# Altium schematic sheet Bandpass.SchDoc: Parametrischer EQ / Spannungsregler
size A4 portrait; DocumentNumber: 3; Revision: 2; SheetNumber: 3; SheetTotal: 4
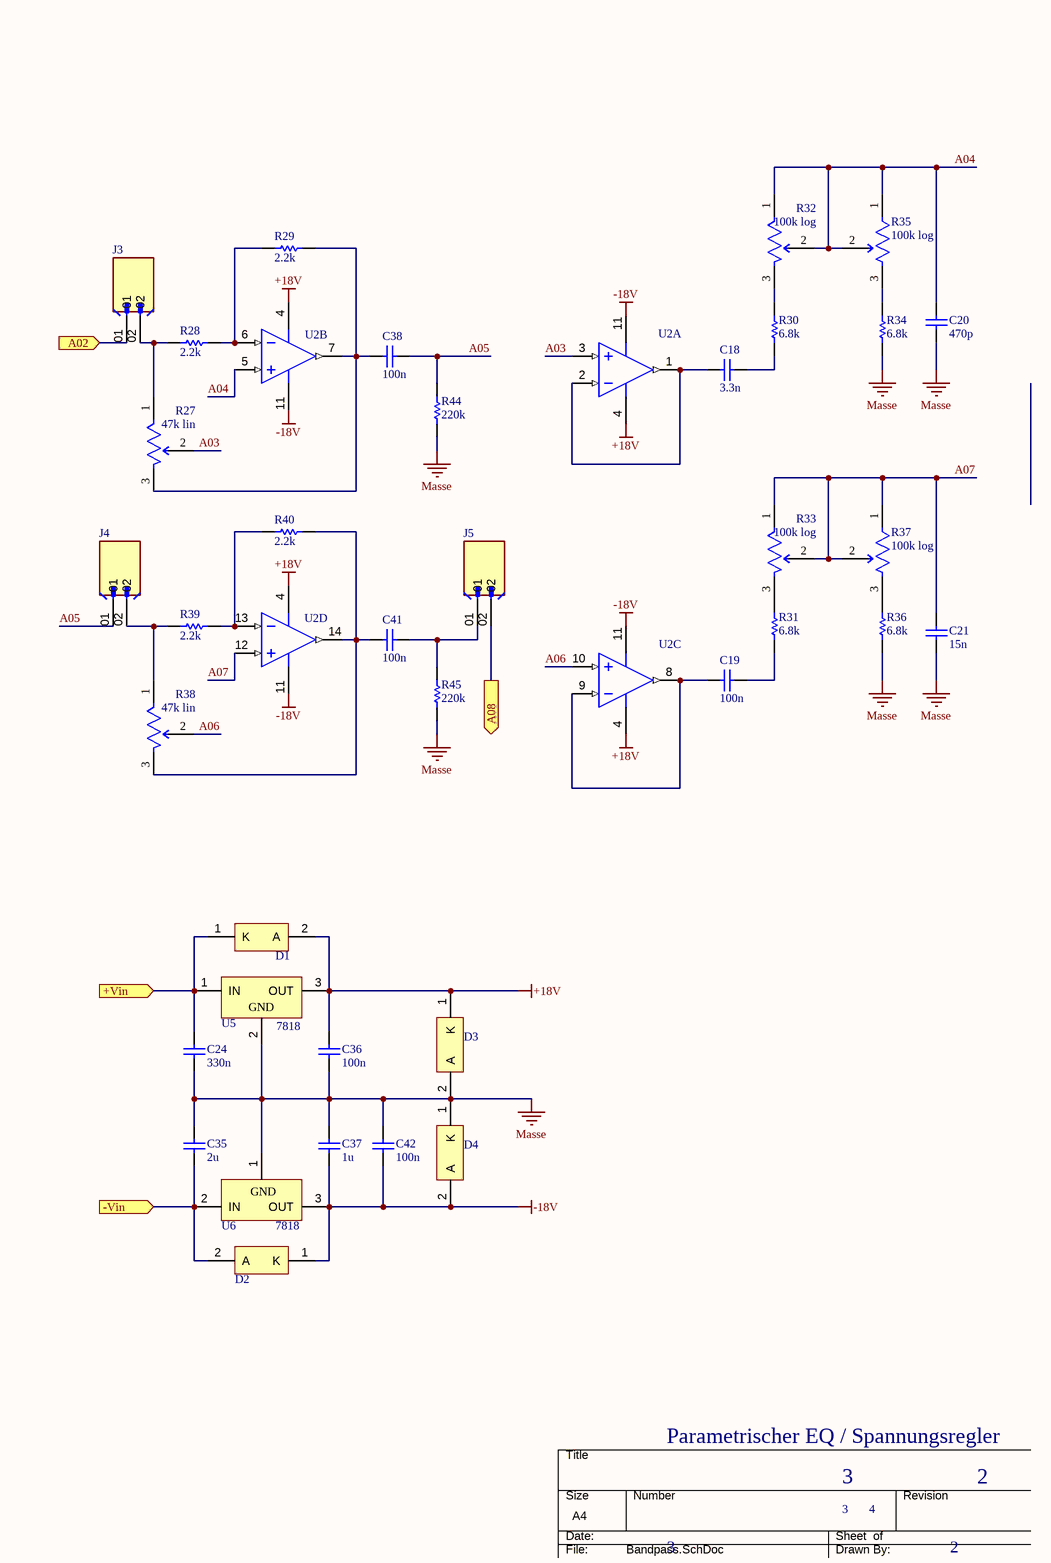
[diagram p0: Bandpass.SchDoc]

## Parts
C18  3.3n  [0805]
C19  100n  [0805]
C20  470p  [0805]
C21  15n  [0805]
C24  330n  [0805]
C35  2u  [0805]
C36  100n  [0805]
C37  1u  [0805]
C38  100n  [0805]
C41  100n  [0805]
C42  100n  [0805]
D1  1N4001 Diode  [1N4001 Diode]  (value not drawn)
D2  1N4001 Diode  [1N4001 Diode]  (value not drawn)
D3  1N4001 Diode  [1N4001 Diode]  (value not drawn)
D4  1N4001 Diode  [1N4001 Diode]  (value not drawn)
J3  Connector x2  [Connector x2]  (value not drawn)
J4  Connector x2  [Connector x2]  (value not drawn)
J5  Connector x2  [Connector x2]  (value not drawn)
R27  47k lin  [Connector x3]
R28  2.2k  [0805]
R29  2.2k  [0805]
R30  6.8k  [0805]
R31  6.8k  [0805]
R32  100k log  [Connector x3]
R33  100k log  [Connector x3]
R34  6.8k  [0805]
R35  100k log  [Connector x3]
R36  6.8k  [0805]
R37  100k log  [Connector x3]
R38  47k lin  [Connector x3]
R39  2.2k  [0805]
R40  2.2k  [0805]
R44  220k  [0805]
R45  220k  [0805]
U2  OPA4134UA  [DIP14 IC Socket]  (value not drawn)  (parts A,B,C,D of 4)
U5  7818  [TO220 Spannungsregler 78xx]
U6  7818  [TO220 Spannungsregler 79xx]

## Ports
+Vin (in), -Vin (in), A02 (in), A08 (out)

## Nets
+18V: C36.2 D1.2(A) D3.1(K) U2.4(V+) U5.3(OUT)
-18V: C37.2 C42.1 D2.1(K) D4.2(A) U2.11(V-) U6.3(OUT)
Masse: C20.1 C21.2 C24.1 C35.1 C36.1 C37.1 C42.2 D3.2(A) D4.1(K) R34.1 R36.2 R44.1 R45.1 U5.2(GND) U6.1(GND)
+Vin: C24.2 D1.1(K) U5.1(IN) ; port +Vin
-Vin: C35.2 D2.2(A) U6.2(IN) ; port -Vin
A02: J3.01 ; port A02
A03: R27.2(b) U2.3(IN_A+)
A04: C20.2 R32.1(a) R32.2(b) R35.1(a) R35.2(b) U2.5(IN_B+)
A05: C38.2 J4.01 R44.2
A06: R38.2(b) U2.10(IN_C+)
A07: C21.1 R33.1(a) R33.2(b) R37.1(a) R37.2(b) U2.12(IN_D+)
A08: J5.02 ; port A08
NetC18_1: C18.1 U2.1(OUT_A) U2.2(IN_A-)
NetC18_2: C18.2 R30.1
NetC19_1: C19.1 R31.2
NetC19_2: C19.2 U2.8(OUT_C) U2.9(IN_C-)
NetC38_1: C38.1 R27.3(c) R29.2 U2.7(OUT_B)
NetC41_1: C41.1 R38.3(c) R40.2 U2.14(OUT_D)
NetC41_2: C41.2 J5.01 R45.2
NetJ3_02: J3.02 R27.1(a) R28.1
NetJ4_02: J4.02 R38.1(a) R39.1
NetR28_2: R28.2 R29.1 U2.6(IN_B-)
NetR30_2: R30.2 R32.3(c)
NetR31_1: R31.1 R33.3(c)
NetR34_2: R34.2 R35.3(c)
NetR36_1: R36.1 R37.3(c)
NetR39_2: R39.2 R40.1 U2.13(IN_D-)

## Notes on the sheet
- THIS DOCUMENT AND THE DATA DISCLOSED HEREIN OR
- HEREWITH IS THE PROPERTY OF ALTIUM LIMITED AND MAY
- DWG NO:
- REVISION
- REV:
- DESCRIPTION
- DATE
- APPROVED
- BE FREELY DISTRIBUTED IN WHOLE. NO RIGHTS ARE
- RESERVED OR EXPRESS OR IMPLIED WARANTEE GIVEN.
- ENG:
- APPROVALS
- PROJECT
- DSN:
- CHK:
- REFERENCE DOCUMENTS
- PROJECT REVISION:
- TITLE
- DOCUMENT REVISION:
- DESIGN ITEM:
- BOM:
- FAB DWG:
- PCB DWG:
- ASSY DWG:
- SCALE:
- A3
- SIZE
- CAGE CODE
- FILE NAME
- DWG NO.
- SHEET
- OF
- REV

## Library data of the parts
C18-C21 C24 C35-C38 C41 C42 = 0805 Kondensator
  C18: Value: 3.3n
  C19 C36 C38 C41 C42: Value: 100n
  C20: Value: 470p
  C21: Value: 15n
  C24: Value: 330n
  C35: Value: 2u
  C37: Value: 1u
D1-D4 = 1N4001 Diode: Standard Recovery Rectifier, 2-Pin Axial_Lead, Pb-Free, Bulk Bag; Manufacturer: On Semiconductor; VRRM Max (V): 50; IFSM Max (A): 30; IO(rec) Max (A): 1; ComponentLink3URL: http://www.onsemi.cn/pub_link/Collateral/59-10.PDF; ComponentLink3Description: Package Specification; PartNumber: 1N4001; PackageVersion: Rev. U, 02/2005; Packing: Bulk Bag; ComponentLink2Description: Datasheet; RoHS: TRUE; DatasheetVersion: Rev. 13; PackageReference: AXIAL_LEAD-2-59-10; ComponentLink1URL: http://www.onsemi.com/; Mounting Technology: Through Hole; PackageDescription: 2-Pin, Axial Lead, Diameter 2.35 mm; ComponentLink2URL: http://www.onsemi.com/pub_link/Collateral/1N4001-D.PDF; Type: Standard Recovery; ComponentLink1Description: Manufacturer URL
J3-J5 = Connector x2: Connector Header Through Hole 2 position 0.100 (2.54mm); MF: Wurth Elektronik; MP: 61300211121; SnapEDA_Link: https://www.snapeda.com/parts/61300211121/Wurth+Elektronik/view-part/?ref=snap; Package: None; Value: *; Check_prices: https://www.snapeda.com/parts/61300211121/Wurth+Elektronik/view-part/?ref=eda
R27 R32 R33 R35 R37 R38 = Potentiometer Buchsenleiste: Potentiometer
  R27 R38: Value: 47k lin
  R32 R33 R35 R37: Value: 100k log
R28-R31 R34 R36 R39 R40 R44 R45 = 0805 Widerstand
  R28 R29 R39 R40: Value: 2.2k
  R30 R31 R34 R36: Value: 6.8k
  R44 R45: Value: 220k
U2 = SOIC OPA4134UA: SoundPlus(TM) High Performance Audio Operational Amplifier, 5 to 36 V, -55 to 125 degC, 14-pin SOIC (D14), Green (RoHS & no Sb/Br); Manufacturer: Texas Instruments; Vmax(V): 36; Number of Channels: 4; Iq per channel(Max)(mA): 5; GBW(Typ)(MHz): 8; DatasheetVersion: SBOS058; ComponentLink2URL: http://www.ti.com/general/docs/lit/getliterature.tsp?genericPartNumber=OPA4134&fileType=pdf; ComponentLink1URL: http://www.ti.com/; PackageDescription: 14-Pin Plastic Small Outline, Body 8.65 x 3.9 mm, Pitch 1.27 mm; SubFamily: Audio Operational Amplifier; Vmin(V): 5; ComponentLink2Description: Datasheet; PackageVersion: 4040047-5/M, 06/2011; Code_JEDEC: MS-012; PackageReference: D0014A; ComponentLink1Description: Manufacturer URL; Vn at Flatband(Typ)(nV/rtHz): 8; Eco-Plan: Green (RoHS & no Sb/Br); Mounting Technology: Surface Mount; ComponentLink3URL: http://www.ti.com/lit/ml/mpds177g/mpds177g.pdf; PartNumber: OPA4134UA; ComponentLink3Description: Package Specification
U5 = TO 220 Spannungsregler 78xx: Voltage Regulator, 3-Pin TO-220; Typ: 7818
U6 = TO 220 Spannungsregler 79xx: Voltage Regulator, 3-Pin TO-220; Typ: 7818